# Altium schematic sheet Main.SchDoc
size A4
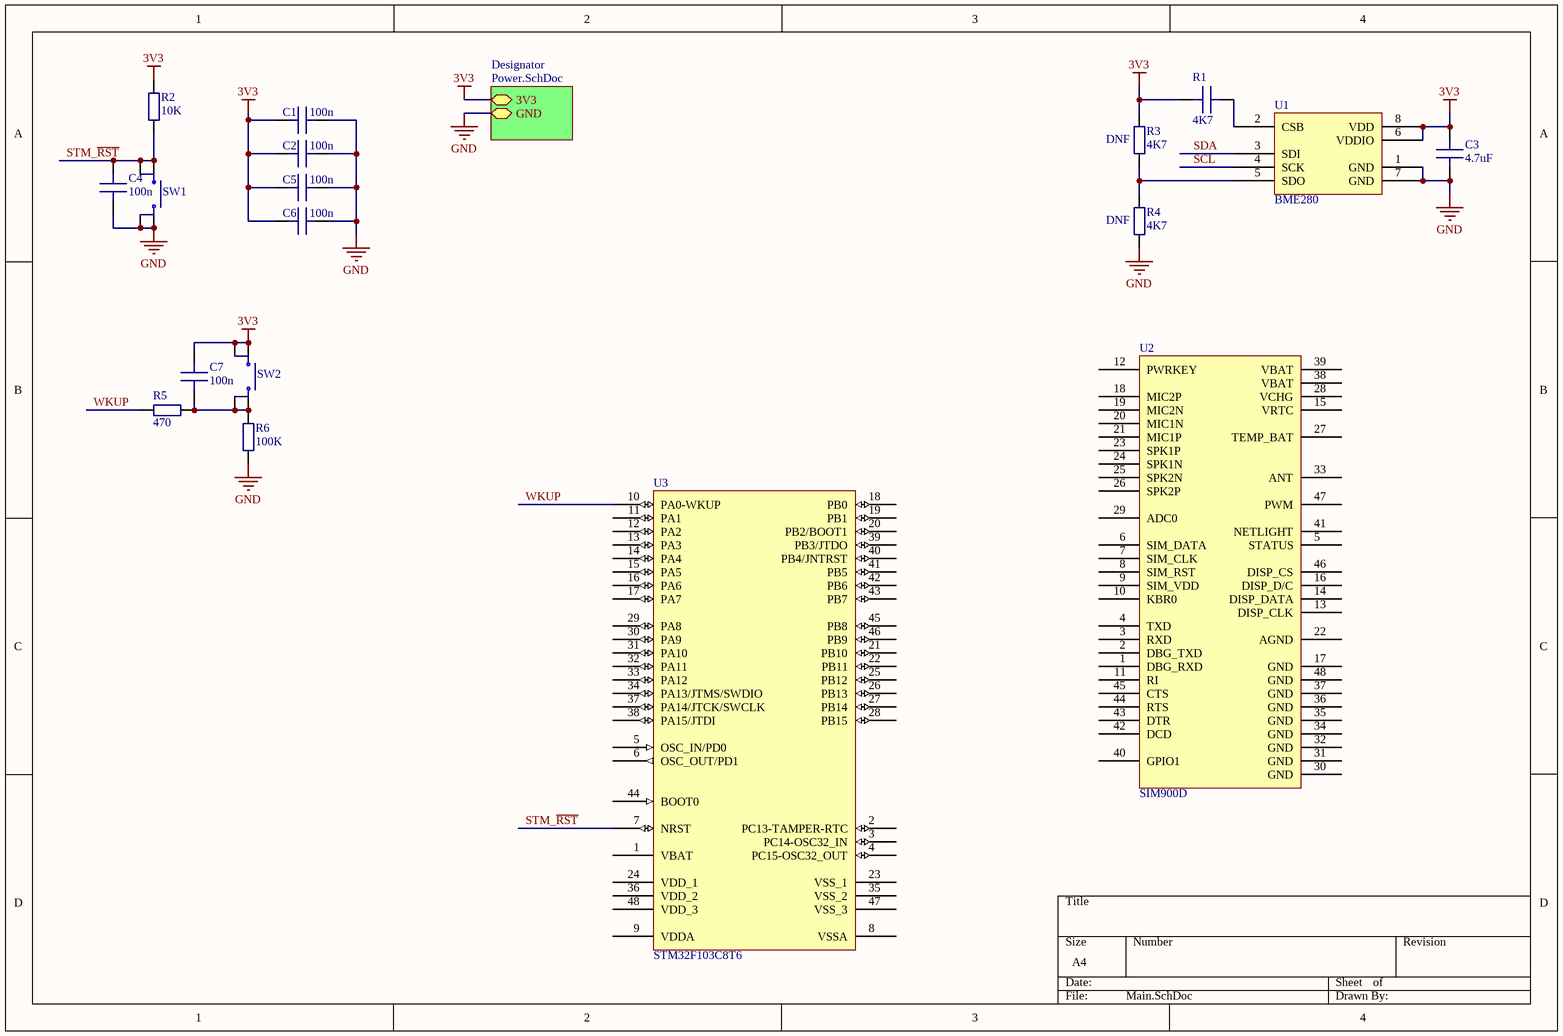
[diagram p0: Main.SchDoc]

## Parts
C1  100n  [C0604]
C2  100n  [C0604]
C3  4.7uF  [C0805]
C4  100n  [C0604]
C5  100n  [C0604]
C6  100n  [C0604]
C7  100n  [C0604]
R1  4K7  [R0805]
R2  10K  [R0805]
R3  4K7  [R0805]
R4  4K7  [R0805]
R5  470  [R0805]
R6  100K  [R0805]
SW1  SWITCH_DIP  [SW_GENERIC]  (value not drawn)
SW2  SWITCH_DIP  [SW_GENERIC]  (value not drawn)
U1  BME280  [BME280]
U2  SIM900D
U3  STM32F103C8T6  [LQFP48_N]

## Sub-sheets
Designator = Power.SchDoc: 3V3, GND

## Nets
3V3: C1.1 C2.1 C3.2 C5.1 C6.1 C7.2 R1.1 R2.2 R3.2 SW2.1 SW2.2 U1.6(VDDIO) U1.8(VDD) ; sheet Designator/3V3
GND: C1.2 C2.2 C3.1 C4.2 C5.2 C6.2 R4.1 R6.1 SW1.3 SW1.4 U1.1(GND) U1.7(GND) ; sheet Designator/GND
SCL: U1.4(SCK)
SDA: U1.3(SDI)
STM_~{RST}: C4.1 R2.1 SW1.1 SW1.2 U3.7(NRST)
WKUP: R5.1 U3.10(PA0-WKUP)
NetC7_1: C7.1 R5.2 R6.2 SW2.3 SW2.4
NetR1_2: R1.2 U1.2(CSB)
NetR3_1: R3.1 R4.2 U1.5(SDO)

Not connected (* = marked no-connect by the designer): U2 1(DBG_RXD) 2(DBG_TXD) 3(RXD) 4(TXD) 5(STATUS) 6(SIM_DATA) 7(SIM_CLK) 8(SIM_RST) 9(SIM_VDD) 10(KBR0) 11(RI) 12(PWRKEY) 13(DISP_CLK) 14(DISP_DATA) 15(VRTC) 16(DISP_D/C) 17(GND) 18(MIC2P) 19(MIC2N) 20(MIC1N) 21(MIC1P) 22(AGND) 23(SPK1P) 24(SPK1N) 25(SPK2N) 26(SPK2P) 27(TEMP_BAT) 28(VCHG) 29(ADC0) 30(GND) 31(GND) 32(GND) 33(ANT) 34(GND) 35(GND) 36(GND) 37(GND) 38(VBAT) 39(VBAT) 40(GPIO1) 41(NETLIGHT) 42(DCD) 43(DTR) 44(RTS) 45(CTS) 46(DISP_CS) 47(PWM) 48(GND); U3 1(VBAT) 2(PC13-TAMPER-RTC) 3(PC14-OSC32_IN) 4(PC15-OSC32_OUT) 5(OSC_IN/PD0) 6(OSC_OUT/PD1) 8(VSSA) 9(VDDA) 11(PA1) 12(PA2) 13(PA3) 14(PA4) 15(PA5) 16(PA6) 17(PA7) 18(PB0) 19(PB1) 20(PB2/BOOT1) 21(PB10) 22(PB11) 23(VSS_1) 24(VDD_1) 25(PB12) 26(PB13) 27(PB14) 28(PB15) 29(PA8) 30(PA9) 31(PA10) 32(PA11) 33(PA12) 34(PA13/JTMS/SWDIO) 35(VSS_2) 36(VDD_2) 37(PA14/JTCK/SWCLK) 38(PA15/JTDI) 39(PB3/JTDO) 40(PB4/JNTRST) 41(PB5) 42(PB6) 43(PB7) 44(BOOT0) 45(PB8) 46(PB9) 47(VSS_3) 48(VDD_3)

## Notes on the sheet
- (near R3) DNF
- (near R4) DNF

## Library data of the parts
C1 C2 C4-C7 = C0603_100n: Capacitor 0603 100n; Value: 100n
C3 = C0805_4u7: Capacitor 0805 4.7uF; Value: 4.7uF
R1 R3 R4 = R0805_4k7: Resistor 0805 4K7; Value: 4K7
R2 = R0805_10K: Resistor 0805 10K; Value: 10K
R5 = R0805_470: Resistor 0805 470; Value: 470
R6 = R0805_100K: Resistor 0805 100K; Value: 100K
SW1 SW2 = SWITCH_DIP: SWITCH DIP 4.3 mm
U1 = BME280: Sensor Temperature humidity
U2 = SIM900D: Module: GSM; CSD, GPRS; 2G; 1800MHz, 900MHz; 85.6kbps; I
U3 = STM32F103C8T6: STM32 ARM-based 32-bit MCU with 64 Kbytes Flash, 48-pin LQFP, Industrial Temperature; Published: 30-May-2008; DatasheetVersion: rev6, Mar-2008; PackageVersion: Mar-2008; PackageReference: LQFP48; Publisher: Altium Limited; PackageDescription: 48-Pin Low-Profile Quad Flat Pack, 7 x 7 mm Body, 0.5 mm Pitch (LQFP48); ComponentLink1Description: Manufacturer Link; ComponentLink1URL: www.st.com/stm32; ComponentLink2Description: Datasheet; ComponentLink2URL: http://www.st.com/stonline/products/literature/ds/13587.pdf